# EAGLE design fab-speakers-noss-edits-diff-ended-input (EAGLE 7.7.0)
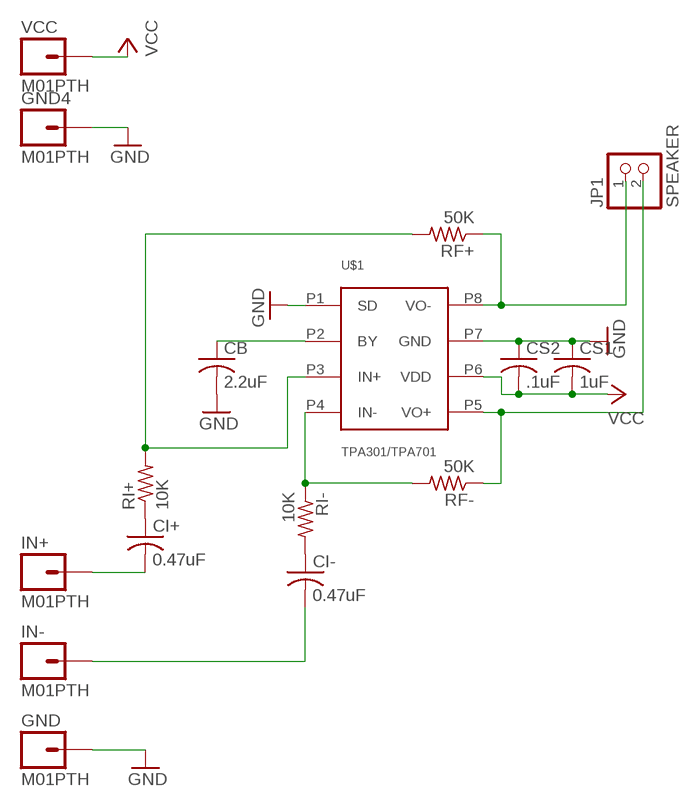
[diagram p0: schematic, sheet 1]

## Parts
CB  2.2uF  C-USC0603  [C0603]
CI+  0.47uF  C-USC0603  [C0603]
CI-  0.47uF  C-USC0603  [C0603]
CS1  1uF  C-USC0603  [C0603]
CS2  .1uF  C-USC0603  [C0603]
GND  M01PTH  [1X01]
GND4  M01PTH  [1X01]
IN+  M01PTH  [1X01]
IN-  M01PTH  [1X01]
JP1  SPEAKER  PINHD-1X2  [1X02]
RF+  50K  R-US_R0603  [R0603]
RF-  50K  R-US_R0603  [R0603]
RI+  10K  R-US_R0603  [R0603]
RI-  10K  R-US_R0603  [R0603]
U$1  TPA301/TPA701  [SOIC8]
VCC  M01PTH  [1X01]

## Nets
GND: CB.2 CS1.1 CS2.1 GND4.1 GND.1 U$1.P1(SD) U$1.P7(GND)
IN+: CI+.2 IN+.1
IN-: CI-.2 IN-.1
N$2: RF+.2 RI+.2 U$1.P3(IN+)
N$3: CI-.1 RI-.2
N$4: CI+.1 RI+.1
N$5: RF-.2 RI-.1 U$1.P4(IN-)
N$11: CB.1 U$1.P2(BY)
O+: JP1.2 RF-.1 U$1.P5(VO+)
O-: JP1.1 RF+.1 U$1.P8(VO-)
VCC: CS1.2 CS2.2 U$1.P6(VDD) VCC.1

## Library data of the parts
CB CI+ CI- CS1 CS2 = rcl:C-US: CAPACITOR, American symbol
GND GND4 IN+ IN- VCC = SparkFun-Connectors:M01: Header 1 Standard 1-pin 0.1" header. Use with straight break away headers (SKU : PRT-00116), right angle break away headers (PRT-00553), swiss pins (PRT-00743), machine pins (PRT-00117), and female headers (PRT-00115).
JP1 = pinhead:PINHD-1X2: PIN HEADER
RF+ RF- RI+ RI- = rcl:R-US_: RESISTOR, American symbol
U$1 = mellis:TPA301/TPA701

## Board
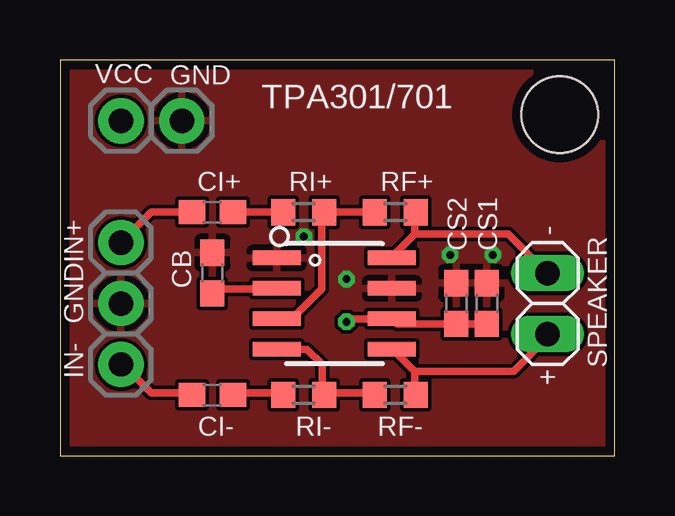
[diagram p1: board, top side]
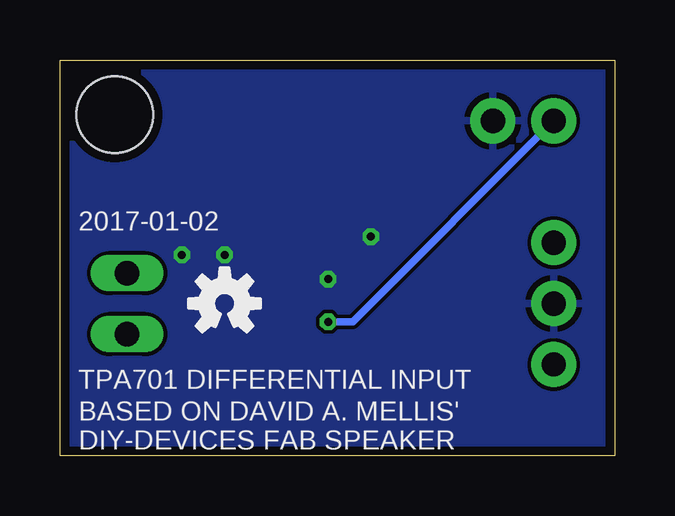
[diagram p2: board, bottom side, seen from below]

Size 23.11 x 16.51 mm. Coordinates in mm from the lower left corner, seen from the top.
Outline: 0,0 23.11,0 23.11,16.51 0,16.51 0,0
Copper layers (1*16): Top 0.0356mm / dielectric 1.5011mm / Bottom 0.0356mm
Design rules "LaenPCBOrder *": minimum track width 12mil, minimum drill 13mil, track to track 6mil, track to pad 6mil, pad to pad 6mil, via to via 6mil, smd to smd 6mil, copper to edge 15mil, drill to drill 6mil, minimum pad ring 7mil, minimum via ring 7mil, stop-mask expansion 3mil, vias tented up to drill 14mil, thermal gap 10mil
Holes 3.2 mm at 20.83,14.22

### Footprints (pad centres in the part's own frame; a part is rotated, then mirrored left to right if it is on the bottom)
C0603 = smd 1.1 x 1: 1 -0.85,0; 2 0.85,0
1X01 = drill 1.016 pad 1.88: 1 0,0
1X02 = drill 1.016 long: 1 -1.27,0; 2 1.27,0
R0603 = smd 1 x 1.1: 1 -0.85,0; 2 0.85,0
SOIC8 = smd 0.6 x 2: P1 1.905,2.4; P2 0.635,2.4; P3 -0.635,2.4; P4 -1.905,2.4; P5 -1.905,-2.4; P6 -0.635,-2.4; P7 0.635,-2.4; P8 1.905,-2.4

### Placement (x,y rotation side)
CB  6.35,7.62 90 top
CI+  6.35,10.16 180 top
CI-  6.35,2.54 180 top
CS1  17.78,6.35 270 top
CS2  16.51,6.35 270 top
GND  2.54,6.35 0 top
GND4  5.08,13.97 0 top
IN+  2.54,8.89 0 top
IN-  2.54,3.81 0 top
JP1  20.32,6.35 270 top
RF+  13.97,10.16 180 top
RF-  13.97,2.54 180 top
RI+  10.16,10.16 0 top
RI-  10.16,2.54 180 top
U$1  11.43,6.35 90 top
U$3  [OSHW-LOGO-S]  16.26,6.35 0 bottom
VCC  2.54,13.97 0 top

### Tracks (layer width: path | path; a pad name or v marks a point on that pad's centre or on a via)
GND  (via drill 0.33)
  other vias: 16.26,8.38 18.03,8.38 11.94,7.37 10.16,9.14
  pour Bottom: 0,16.51 23.11,16.51 23.11,0 0,0
  pour Top: 0,16.51 23.11,16.51 23.11,0 0,0
IN+
  Top 0.305: CI+.2 3.81,10.16 IN+.1
IN-
  Top 0.305: CI-.2 5.41,2.62 3.81,2.62 2.67,3.76 IN-.1
N$2
  Top 0.305: RF+.2 RI+.2 10.9,10.16 10.9,6.96 9.75,5.82 9.07,5.82 U$1.P3
N$3
  Top 0.305: CI-.1 7.24,2.62 9.3,2.62 RI-.2
N$4
  Top 0.305: RI+.1 CI+.1
N$5
  Top 0.305: RF-.2 12.95,2.62 11.12,2.62 RI-.1 10.92,2.63 10.92,3.81 10.29,4.45 U$1.P4
N$11
  Top 0.305: CB.1 6.55,6.96 8.84,6.96 U$1.P2
O+
  Top 0.305: 14.78,3.53 14.78,2.62 RF-.1 | 14.78,3.53 13.87,4.45 U$1.P5 | 14.78,3.53 18.9,3.53 20.27,4.9 JP1.2
O-
  Top 0.305: 14.78,9.25 14.78,10.16 RF+.1 | 14.78,9.25 13.87,8.33 U$1.P8 | 14.78,9.25 18.67,9.25 20.27,7.64 JP1.1
VCC  (via drill 0.33)
  Top 0.305: v11.94,5.59 12.06,5.71 U$1.P6 14.04,5.5 CS2.2 CS1.2
  Bottom 0.305: VCC.1 10.92,5.59 v11.94,5.59

### Text on the board
tPlace: GND | TPA301/701 | - | +
bPlace: 2017-01-02 | TPA701 DIFFERENTIAL INPUT | BASED ON DAVID A. MELLIS' / DIY-DEVICES FAB SPEAKER
tValues: - | + | Fab Speakers, David A. Mellis | High-Low Tech, MIT Media Lab | August 2, 2012 | http://web.media.mit.edu/~mellis/speakers/
bValues: OFF | ON